# Altium schematic sheet 4_DIGITAL.SchDoc
size 420 x 297 mm; SheetNumber: 4; SheetTotal: 5
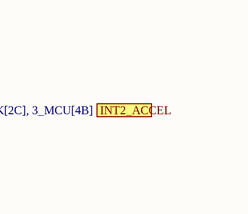
[diagram p0: 4_DIGITAL.SchDoc, left]
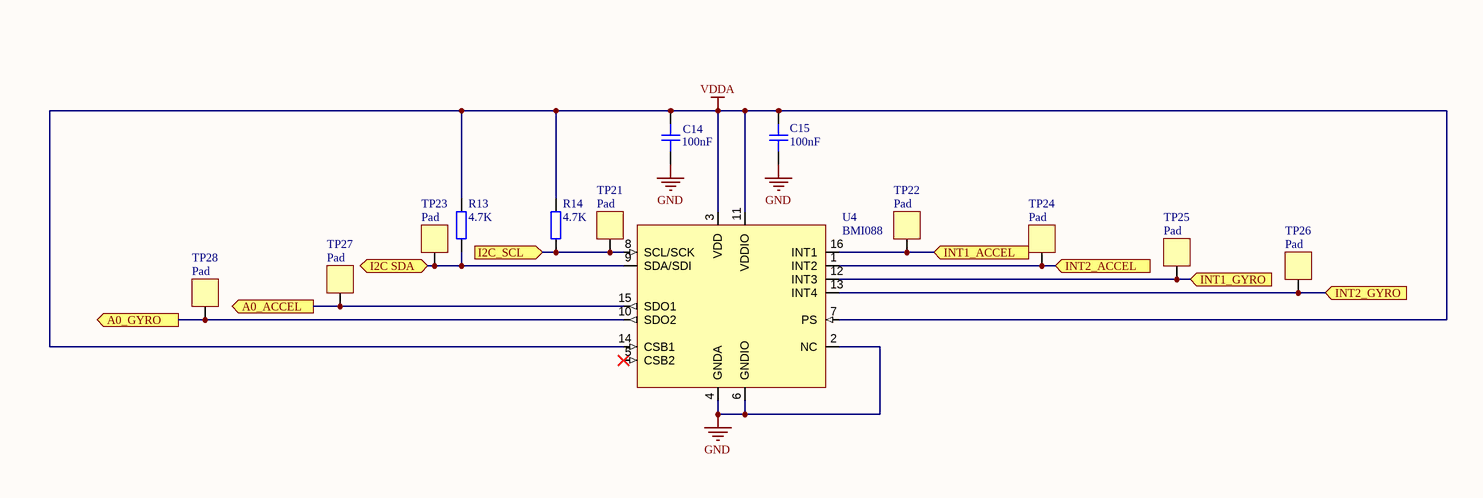
[diagram p1: 4_DIGITAL.SchDoc, right]

## Parts
C14  100nF  [CAP_0603]
C15  100nF  [CAP_0603]
R13  4.7K  [RES_0603]
R14  4.7K  [RES_0603]
TP21  Pad  [PAD_SQ_2MM]  (no BOM)
TP22  Pad  [PAD_SQ_2MM]  (no BOM)
TP23  Pad  [PAD_SQ_2MM]  (no BOM)
TP24  Pad  [PAD_SQ_2MM]  (no BOM)
TP25  Pad  [PAD_SQ_2MM]  (no BOM)
TP26  Pad  [PAD_SQ_2MM]  (no BOM)
TP27  Pad  [PAD_SQ_2MM]  (no BOM)
TP28  Pad  [PAD_SQ_2MM]  (no BOM)
U4  BMI088  [BMI088]

## Ports
A0_ACCEL (out, see 1_BLOCK[2C], 3_MCU[4B]), A0_GYRO (out, see 1_BLOCK[2C], 3_MCU[4B]), I2C SDA (bidir, see 1_BLOCK[2C], 3_MCU[3B]), I2C_SCL (in, see 1_BLOCK[2C], 3_MCU[3B]), INT1_ACCEL (in, see 1_BLOCK[2C], 3_MCU[4B]), INT1_GYRO (in, see 1_BLOCK[2C], 3_MCU[4B]), INT2_ACCEL (in, see 1_BLOCK[2C], 3_MCU[4B]), INT2_ACCEL (see 1_BLOCK[2C], 3_MCU[4B]), INT2_GYRO (in, see 1_BLOCK[2C], 3_MCU[4B])

## Nets
GND: C14.1 C15.1 U4.2(NC) U4.4(GNDA) U4.6(GNDIO)
VDDA: C14.2 C15.2 R13.2 R14.2 U4.3(VDD) U4.7(PS) U4.11(VDDIO) U4.14(CSB1)
A0_ACCEL: TP27.1 U4.15(SDO1) ; port A0_ACCEL
A0_GYRO: TP28.1 U4.10(SDO2) ; port A0_GYRO
I2C SDA: R13.1 TP23.1 U4.9(SDA/SDI) ; port I2C SDA
I2C_SCL: R14.1 TP21.1 U4.8(SCL/SCK) ; port I2C_SCL
INT1_ACCEL: TP22.1 U4.16(INT1) ; port INT1_ACCEL
INT1_GYRO: TP25.1 U4.12(INT3) ; port INT1_GYRO
INT2_ACCEL: TP24.1 U4.1(INT2) ; port INT2_ACCEL
INT2_GYRO: TP26.1 U4.13(INT4) ; port INT2_GYRO

Not connected (* = marked no-connect by the designer): U4 5(CSB2)*

## Notes on the sheet
- THIS DOCUMENT AND THE DATA DISCLOSED HEREIN OR
- HEREWITH IS THE PROPERTY OF ALTIUM LIMITED AND MAY
- DWG NO:
- REVISION
- REV:
- DESCRIPTION
- DATE
- APPROVED
- BE FREELY DISTRIBUTED IN WHOLE. NO RIGHTS ARE
- RESERVED OR EXPRESS OR IMPLIED WARANTEE GIVEN.
- ENG:
- APPROVALS
- PROJECT
- DSN:
- CHK:
- REFERENCE DOCUMENTS
- PROJECT REVISION:
- TITLE
- DOCUMENT REVISION:
- DESIGN ITEM:
- BOM:
- FAB DWG:
- PCB DWG:
- ASSY DWG:
- SCALE:
- A3
- SIZE
- CAGE CODE
- FILE NAME
- DWG NO.
- SHEET
- OF
- REV

## Library data of the parts
C14 C15 = CAP_0603_16V: Capacitor SMD 0603 16V
R13 R14 = RES_0603: Resistor SMD 0603; Manufacturer: *; Manufacturer Part Number: *; Distributor Link: *
TP21-TP28 = PAD_SQ_2MM: Test Point Square 2mm
U4 = BMI088: Inertial Measurement Unit IMU 6-Axis LGA; Manufacturer: Bosch; Manufacturer Part Number: BMI088